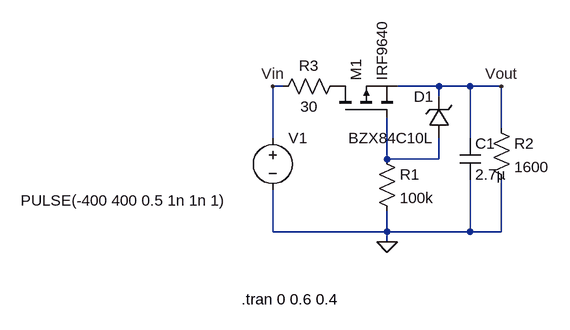
[diagram p0: schematic reverse voltage.asc]
reverse voltage.asc, the LTspice schematic file:
Version 4
SHEET 1 1092 680
WIRE 16 112 0 112
WIRE 256 112 192 112
WIRE 304 112 256 112
WIRE 352 112 304 112
WIRE 256 128 256 112
WIRE 352 176 352 112
WIRE 0 192 0 112
WIRE 304 192 304 112
WIRE 176 224 176 160
WIRE 256 224 256 192
WIRE 256 224 176 224
WIRE 0 336 0 272
WIRE 176 336 176 304
WIRE 176 336 0 336
WIRE 304 336 304 256
WIRE 304 336 176 336
WIRE 352 336 352 256
WIRE 352 336 304 336
WIRE 176 352 176 336
FLAG 176 352 0
FLAG 0 112 Vin
FLAG 352 112 Vout
SYMBOL pmos 96 160 R270
SYMATTR InstName M1
SYMATTR Value IRF9640
SYMBOL res 160 208 R0
SYMATTR InstName R1
SYMATTR Value 100k
SYMBOL zener 272 192 R180
WINDOW 0 24 64 Left 2
WINDOW 3 24 0 Left 2
SYMATTR InstName D1
SYMATTR Value BZX84C10L
SYMBOL voltage 0 176 R0
WINDOW 123 0 0 Left 0
WINDOW 39 0 0 Left 0
WINDOW 3 -388 112 Left 2
SYMATTR InstName V1
SYMATTR Value PULSE(-400 400 0.5 1n 1n 1)
SYMBOL res 336 160 R0
SYMATTR InstName R2
SYMATTR Value 1600
SYMBOL cap 288 192 R0
SYMATTR InstName C1
SYMATTR Value 2.7µ
SYMBOL res 112 96 R90
WINDOW 0 0 56 VBottom 2
WINDOW 3 32 56 VTop 2
SYMATTR InstName R3
SYMATTR Value 30
TEXT -48 440 Left 2 !.tran 0 0.6 0.4

The netlist it stands for:
* reverse voltage.asc
M1 P001 N001 Vout Vout IRF9640
R1 N001 0 100k
D1 N001 Vout BZX84C10L
V1 Vin 0 PULSE(-400 400 0.5 1n 1n 1)
R2 Vout 0 1600
C1 Vout 0 2.7µ
R3 P001 Vin 30
.model D D
.lib standard.dio
.model NMOS NMOS
.model PMOS PMOS
.lib standard.mos
.tran 0 0.6 0.4
.backanno
.end